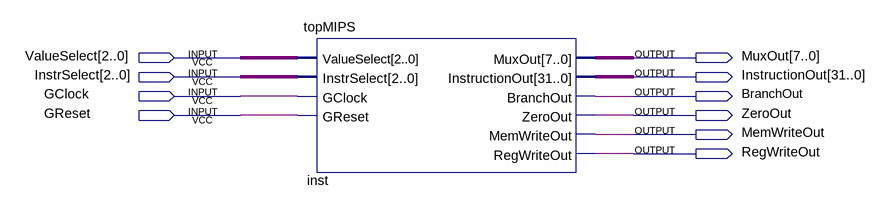
[diagram p0: schematic sheet]
// Quartus schematic top_level_bdf.bdf as structural Verilog: 1 symbols, 10 pins
module top_level_bdf (
  input  [2:0] ValueSelect,
  input  [2:0] InstrSelect,
  input  GClock,
  input  GReset,
  output [7:0] MuxOut,
  output [31:0] InstructionOut,
  output BranchOut,
  output ZeroOut,
  output MemWriteOut,
  output RegWriteOut
);

  topMIPS inst (
    .ValueSelect(ValueSelect), .InstrSelect(InstrSelect), .GClock(GClock), .GReset(GReset), .MuxOut(MuxOut),
    .InstructionOut(InstructionOut), .BranchOut(BranchOut), .ZeroOut(ZeroOut), .MemWriteOut(MemWriteOut),
    .RegWriteOut(RegWriteOut));
endmodule
